# Altium schematic sheet Experiment 2 0.0.0.SchDoc
size A4; Organization: Altium Limited; Address1: L3, 12a Rodborough Rd; Address2: Frenchs Forest; Address3: NSW; Address4: Australia 2086; DocumentNumber: 2; SheetNumber: 2; SheetTotal: 5
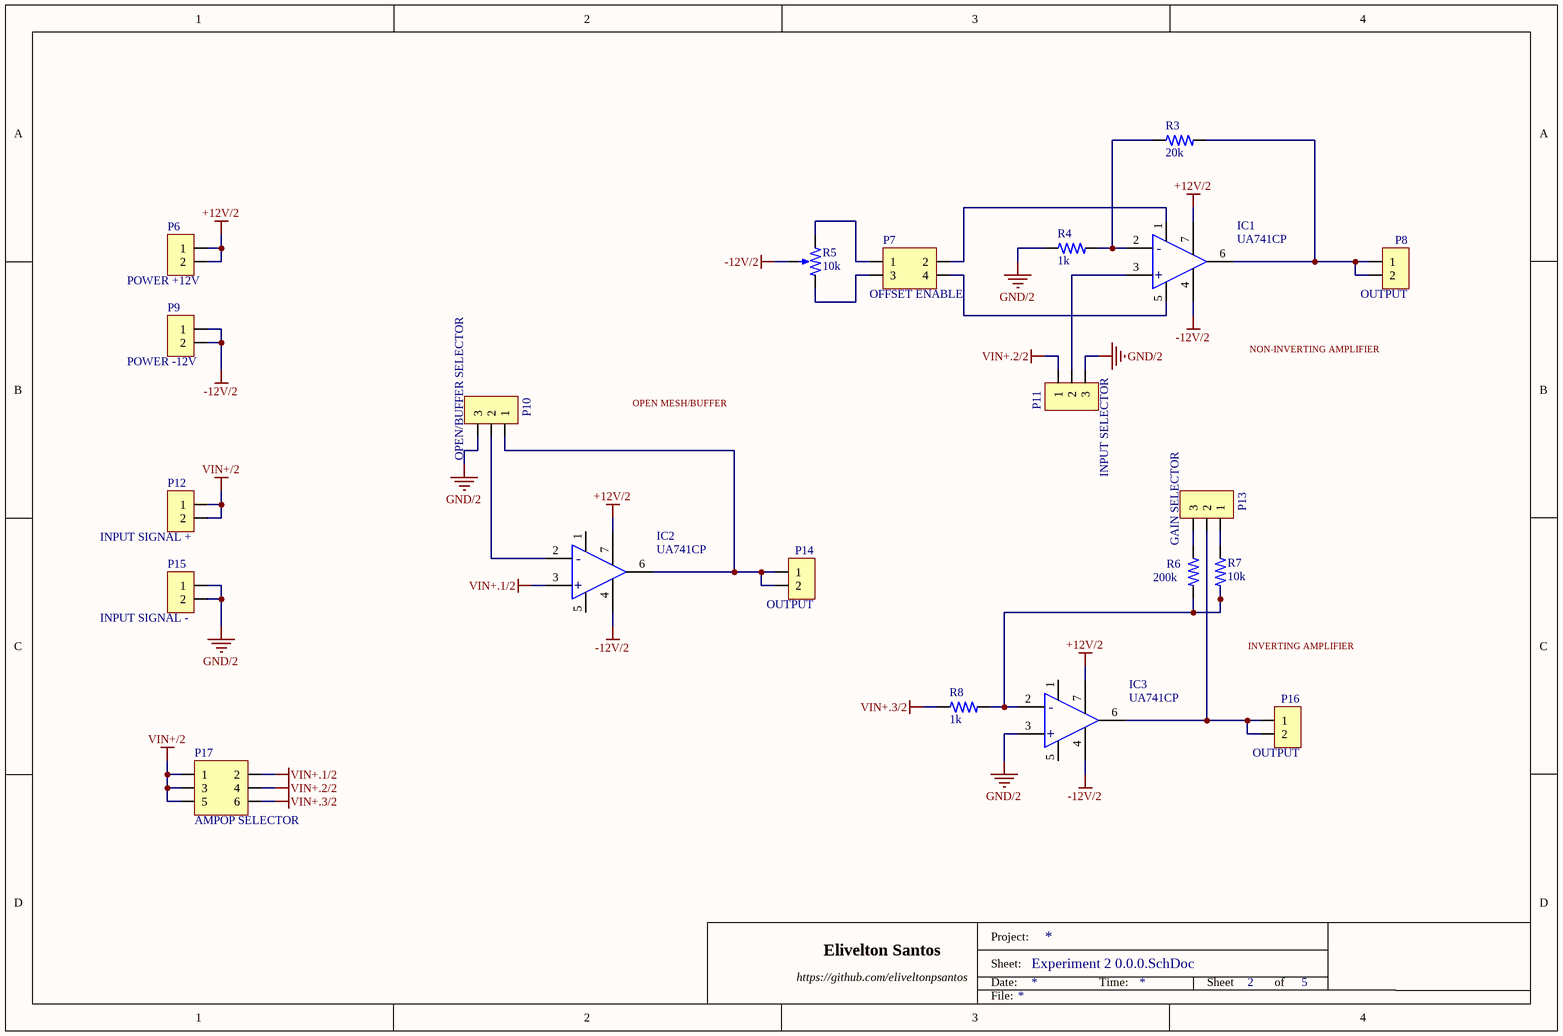
[diagram p0: Experiment 2 0.0.0.SchDoc]

## Parts
IC1  UA741CP  [DIP-8]
IC2  UA741CP  [DIP-8]
IC3  UA741CP  [DIP-8]
P6  POWER +12V  [PINHD-1X02 ONCE]
P7  OFFSET ENABLE  [PINHD-2X02]
P8  OUTPUT  [PINHD-1X02 ONCE]
P9  POWER -12V  [PINHD-1X02 ONCE]
P10  OPEN/BUFFER SELECTOR  [PINHD-1X03]
P11  INPUT SELECTOR  [PINHD-1X03]
P12  INPUT SIGNAL +  [PINHD-1X02 ONCE]
P13  GAIN SELECTOR  [PINHD-1X03]
P14  OUTPUT  [PINHD-1X02 ONCE]
P15  INPUT SIGNAL -  [PINHD-1X02 ONCE]
P16  OUTPUT  [PINHD-1X02 ONCE]
P17  AMPOP SELECTOR  [PINHD-2X03]
R3  20k  [R Axial 0.25]
R4  1k  [R Axial 0.25]
R5  10k  [PV36W]
R6  200k  [R Axial 0.25]
R7  10k  [R Axial 0.25]
R8  1k  [R Axial 0.25]

## Nets
+12V/2: IC1.7(VCC+) IC2.7(VCC+) IC3.7(VCC+) P6.1 P6.2
-12V/2: IC1.4(VCC-) IC2.4(VCC-) IC3.4(VCC-) P9.1 P9.2 R5.2
GND/2: IC3.3(+) P10.3 P11.3 P15.1 P15.2 R4.1
VIN+.1/2: IC2.3(+) P17.2
VIN+.2/2: P11.1 P17.4
VIN+.3/2: P17.6 R8.1
VIN+/2: P12.1 P12.2 P17.1 P17.3 P17.5
NetIC1_1: IC1.1(OFFSET1) P7.2
NetIC1_2: IC1.2(-) R3.1 R4.2
NetIC1_3: IC1.3(+) P11.2
NetIC1_5: IC1.5(OFFSET2) P7.4
NetIC1_6: IC1.6(OUTPUT) P8.1 P8.2 R3.2
NetIC2_2: IC2.2(-) P10.2
NetIC2_6: IC2.6(OUTPUT) P10.1 P14.1 P14.2
NetIC3_2: IC3.2(-) R6.1 R7.2 R8.2
NetIC3_6: IC3.6(OUTPUT) P13.2 P16.1 P16.2
NetP7_1: P7.1 R5.1
NetP7_3: P7.3 R5.3
NetP13_1: P13.1 R7.1
NetP13_3: P13.3 R6.2

Not connected (* = marked no-connect by the designer): IC2 1(OFFSET1) 5(OFFSET2); IC3 1(OFFSET1) 5(OFFSET2)

## Notes on the sheet
- NON-INVERTING AMPLIFIER
- OPEN MESH/BUFFER
- INVERTING AMPLIFIER
- Elivelton Santos
- https://github.com/eliveltonpsantos
- Project:
- Sheet:
- Date:
- Time:
- Sheet
- of
- File:

## Library data of the parts
IC1-IC3 = UA741CP: IC OPAMP GP 1MHZ 8DIP; Manufacturer: Texas Instruments; Category: ICs; Manufacturer Part Number: UA741CP; Package / Case: 8-PDIP; Supplier 1: Digi-Key; Supplier Part Number 1: 296-11107-5-ND
P6 P8 P9 P12 P14-P16 = PIN HEADER 1X02 ONCE: CONN HEADER 2POS .100" STR TIN; Manufacturer: Molex, LLC; Manufacturer Part Number: 0901200122; Category: Connectors; Supplier 1: Digi-Key; Supplier Part Number 1: WM8072-ND
P7 = PIN HEADER 2X02: CONN HEADER 4POS .100" STR TIN; Manufacturer: Molex, LLC; Manufacturer Part Number: 0901310122; Category: Connectors; Supplier 1: Digi-Key; Supplier Part Number 1: WM8120-ND
P10 P11 P13 = PIN HEADER 1X03: CONN HEADER 3POS .100" STR TIN; Manufacturer: Molex, LLC; Manufacturer Part Number: 0901200123; Category: Connectors; Supplier 1: Digi-Key; Supplier Part Number 1: WM8073-ND
P17 = PIN HEADER 2X03: CONN HEADER 6POS .100" STR TIN; Manufacturer: Molex, LLC; Manufacturer Part Number: 0901310123; Category: Connectors; Supplier 1: Digi-Key; Supplier Part Number 1: WM8121-ND
R3 = CFR-25JB-52-20K: RES 20K OHM 1/4W 5% AXIAL; Manufacturer: Yageo; Power (Watts): 0.25W, 1/4W; Category: Resistors; Manufacturer Part Number: CFR-25JB-52-20K; Package / Case: Axial; Resistance (Ohms): 20k; Tolerance: ±5%; Supplier 1: Digi-Key; Supplier Part Number 1: 20KQBK-ND
R4 R8 = CFR-25JB-52-1K: RES 1K OHM 1/4W 5% AXIAL; Manufacturer: Yageo; Power (Watts): 0.25W, 1/4W; Category: Resistors; Manufacturer Part Number: CFR-25JB-52-1K; Package / Case: Axial; Resistance (Ohms): 1k; Tolerance: ±5%; Supplier 1: Digi-Key; Supplier Part Number 1: 1.0KQBK-ND
R5 = PV36W103C01B00: TRIMMER 10K OHM 0.5W TH; Manufacturer: Bourns Inc.; Power (Watts): 0.5W, 1/2W; Tolerance: ±10%; Number of Turns: 25; Adjustment Type: Top Adjustment; Category: Resistors; Manufacturer Part Number: PV36W103C01B00; Resistance (Ohms): 10k; Supplier 1: Digi-Key; Supplier Part Number 1: 490-2875-ND
R6 = CFR-25JB-52-200K: RES 200K OHM 1/4W 5% AXIAL; Manufacturer: Yageo; Power (Watts): 0.25W, 1/4W; Category: Resistors; Manufacturer Part Number: CFR-25JB-52-200K; Package / Case: Axial; Resistance (Ohms): 200k; Tolerance: ±5%; Supplier 1: Digi-Key; Supplier Part Number 1: 200KQBK-ND
R7 = CFR-25JB-52-10K: RES 10K OHM 1/4W 5% AXIAL; Manufacturer: Yageo; Power (Watts): 0.25W, 1/4W; Category: Resistors; Manufacturer Part Number: CFR-25JB-52-10K; Package / Case: Axial; Resistance (Ohms): 10k; Tolerance: ±5%; Supplier 1: Digi-Key; Supplier Part Number 1: 10KQBK-ND